# Altium schematic sheet Stepper drivers.SchDoc: Stepper Drivers
size A4; DrawnBy: oaba200
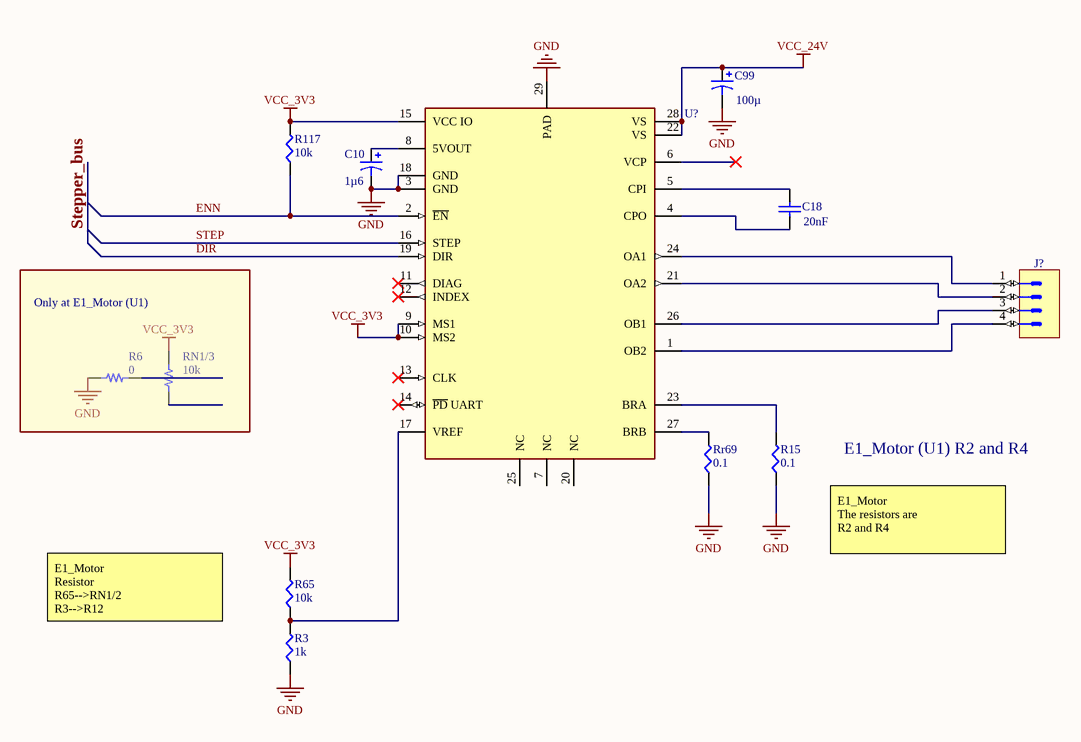
[diagram p0: Stepper drivers.SchDoc]

## Parts
C10  value 1µ6  [C0805]  (hidden comment: Cap Pol3)
C18  value 20nF  [C1206]  (hidden comment: Cap Semi)
C99  value 100µ  [C0805]  (hidden comment: Cap Pol3)
J?  (no value)
R3  1k  [SMD-0402-RES]
R6  0  [RES 0805_2012]
R15  0.1  [SMD-0402-RES]
R65  10k  [SMD-0402-RES]
R117  10k  [SMD-0402-RES]
RN1/3  10k  [RES 0805_2012]
Rr69  0.1  [SMD-0402-RES]
U?  TMC2208-LA  (value not drawn)

## Blocks framed on the sheet
Only at E1_Motor (U1): R6 RN1/3

## Nets
GND: C10.2 C99.2 R3.1 R6.1 R15.1 Rr69.1 U?.3(GND) U?.18(GND) U?.29(PAD)
VCC_3V3: R65.2 R117.2 RN1/3.2 U?.9(MS1) U?.10(MS2) U?.15(VCC_IO)
VCC_24V: C99.1 U?.22(VS) U?.28(VS)
DIR: U?.19(DIR)
ENN: R117.1 U?.2(~{EN})
STEP: U?.16(STEP)
NetC10_1: C10.1 U?.8(5VOUT)
NetC18_1: C18.1 U?.5(CPI)
NetC18_2: C18.2 U?.4(CPO)
NetJ?_1: J?.1 U?.24(OA1)
NetJ?_2: J?.2 U?.21(OA2)
NetJ?_3: J?.3 U?.26(OB1)
NetJ?_4: J?.4 U?.1(OB2)
NetR3_2: R3.2 R65.1 U?.17(VREF)
NetR15_2: R15.2 U?.23(BRA)
NetRr69_2: Rr69.2 U?.27(BRB)

Not connected (* = marked no-connect by the designer): R6 2; RN1/3 1; U? 6(VCP)* 7(NC) 11(DIAG)* 12(INDEX)* 13(CLK)* 14(~{PD}_UART)* 20(NC) 25(NC)

## Buses and harness runs
bus Stepper_bus

## Notes on the sheet
- E1_Motor (U1) R2 and R4
- E1_Motor
  The resistors are
  R2 and R4
- E1_Motor
  Resistor
  R65-->RN1/2
  R3-->R12

## Library data of the parts
C10 C99 = Cap Pol3: Polarized Capacitor (Surface Mount); Published: 8-Jun-2000; LatestRevisionDate: 29-May-2009; LatestRevisionNote: IPC-7351 Footprint Added.; PackageReference: C0805; Publisher: Altium Limited; PackageDescription: Chip Capacitor
C18 = Cap Semi: Capacitor (Semiconductor SIM Model); Published: 8-Jun-2000; LatestRevisionDate: 29-May-2009; LatestRevisionNote: IPC-7351 Footprint Added.; PackageReference: C1206; Publisher: Altium Limited; PackageDescription: Chip Capacitor
J? = Connector 4 Male
R3 R65 = ERJ-2GEJ103X: RES SMD 10K OHM 5% 1/10W 0402; Manufacturer: Panasonic Electronic Components; Factory Stock: 0; Unit Price (USD): 0.00350; @ qty: 1500; Minimum Quantity: 1; Power (Watts): 0.1W, 1/10W; Temperature Coefficient: ±200ppm/°C; Part Number: ERJ-2GEJ103X; Datasheets: http://industrial.panasonic.com/www-cgi/jvcr13pz.cgi?E+PZ+3+AOA0001+ERJ2GEJ103X+7+WW; Image: //media.digikey.com/Photos/Panasonic%20Photos/ERJ-PA2-Series.jpg; Digi-Key Part Number: P10KJCT-ND; Quantity Available: 2560215; Packaging: Cut Tape (CT); Series: ERJ; Part Status: Active; Tolerance: ±5%; Composition: Thick Film; Features: Automotive AEC-Q200; Operating Temperature: -55°C ~ 155°C; Package / Case: 0402 (1005 Metric); Supplier Device Package: 0402; Size / Dimension: 0.039" L x 0.020" W (1.00mm x 0.50mm); Height - Seated (Max): 0.016" (0.40mm); Number of Terminations: 2; Failure Rate: -
  R3: Value: 1k
  R65: Value: 10k
R6 RN1/3 = Resistor: SMT Resistor
  R6: VALUE: 0
  RN1/3: VALUE: 10k
R15 Rr69 = ERJ-2BSFR11X: RES SMD 0.11 OHM 1% 1/6W 0402; Manufacturer: Panasonic Electronic Components; Factory Stock: 0; Unit Price (USD): 0.10632; @ qty: 1500; Minimum Quantity: 1; Power (Watts): 0.167W, 1/6W; Temperature Coefficient: ±300ppm/°C; Part Number: ERJ-2BSFR11X; Datasheets: https://industrial.panasonic.com/cdbs/www-data/pdf/RDA0000/AOA0000C239.pdf; Image: //media.digikey.com/Photos/Panasonic%20Photos/ERJ-PA2-Series.jpg; Digi-Key Part Number: P.11AKCT-ND; Quantity Available: 9397; Packaging: Cut Tape (CT); Series: ERJ; Part Status: Active; Value: 0.1; Tolerance: ±1%; Composition: Thick Film; Features: Automotive AEC-Q200, Current Sense; Operating Temperature: -55°C ~ 125°C; Package / Case: 0402 (1005 Metric); Supplier Device Package: 0402; Size / Dimension: 0.039" L x 0.020" W (1.00mm x 0.50mm); Height - Seated (Max): 0.016" (0.40mm); Number of Terminations: 2; Failure Rate: -
R117 = ERJ-2GEJ203X: RES SMD 20K OHM 5% 1/10W 0402; Manufacturer: Panasonic Electronic Components; Factory Stock: 0; Unit Price (USD): 0.00350; @ qty: 1500; Minimum Quantity: 1; Power (Watts): 0.1W, 1/10W; Temperature Coefficient: ±200ppm/°C; Part Number: ERJ-2GEJ203X; Datasheets: http://industrial.panasonic.com/www-cgi/jvcr13pz.cgi?E+PZ+3+AOA0001+ERJ2GEJ203X+7+WW; Image: //media.digikey.com/Photos/Panasonic%20Photos/ERJ-PA2-Series.jpg; Digi-Key Part Number: P20KJCT-ND; Quantity Available: 191642; Packaging: Cut Tape (CT); Series: ERJ; Part Status: Active; Value: 10k; Tolerance: ±5%; Composition: Thick Film; Features: Automotive AEC-Q200; Operating Temperature: -55°C ~ 155°C; Package / Case: 0402 (1005 Metric); Supplier Device Package: 0402; Size / Dimension: 0.039" L x 0.020" W (1.00mm x 0.50mm); Height - Seated (Max): 0.016" (0.40mm); Number of Terminations: 2; Failure Rate: -